# Altium project ELOAD.PrjPcb (part 1 of 2)
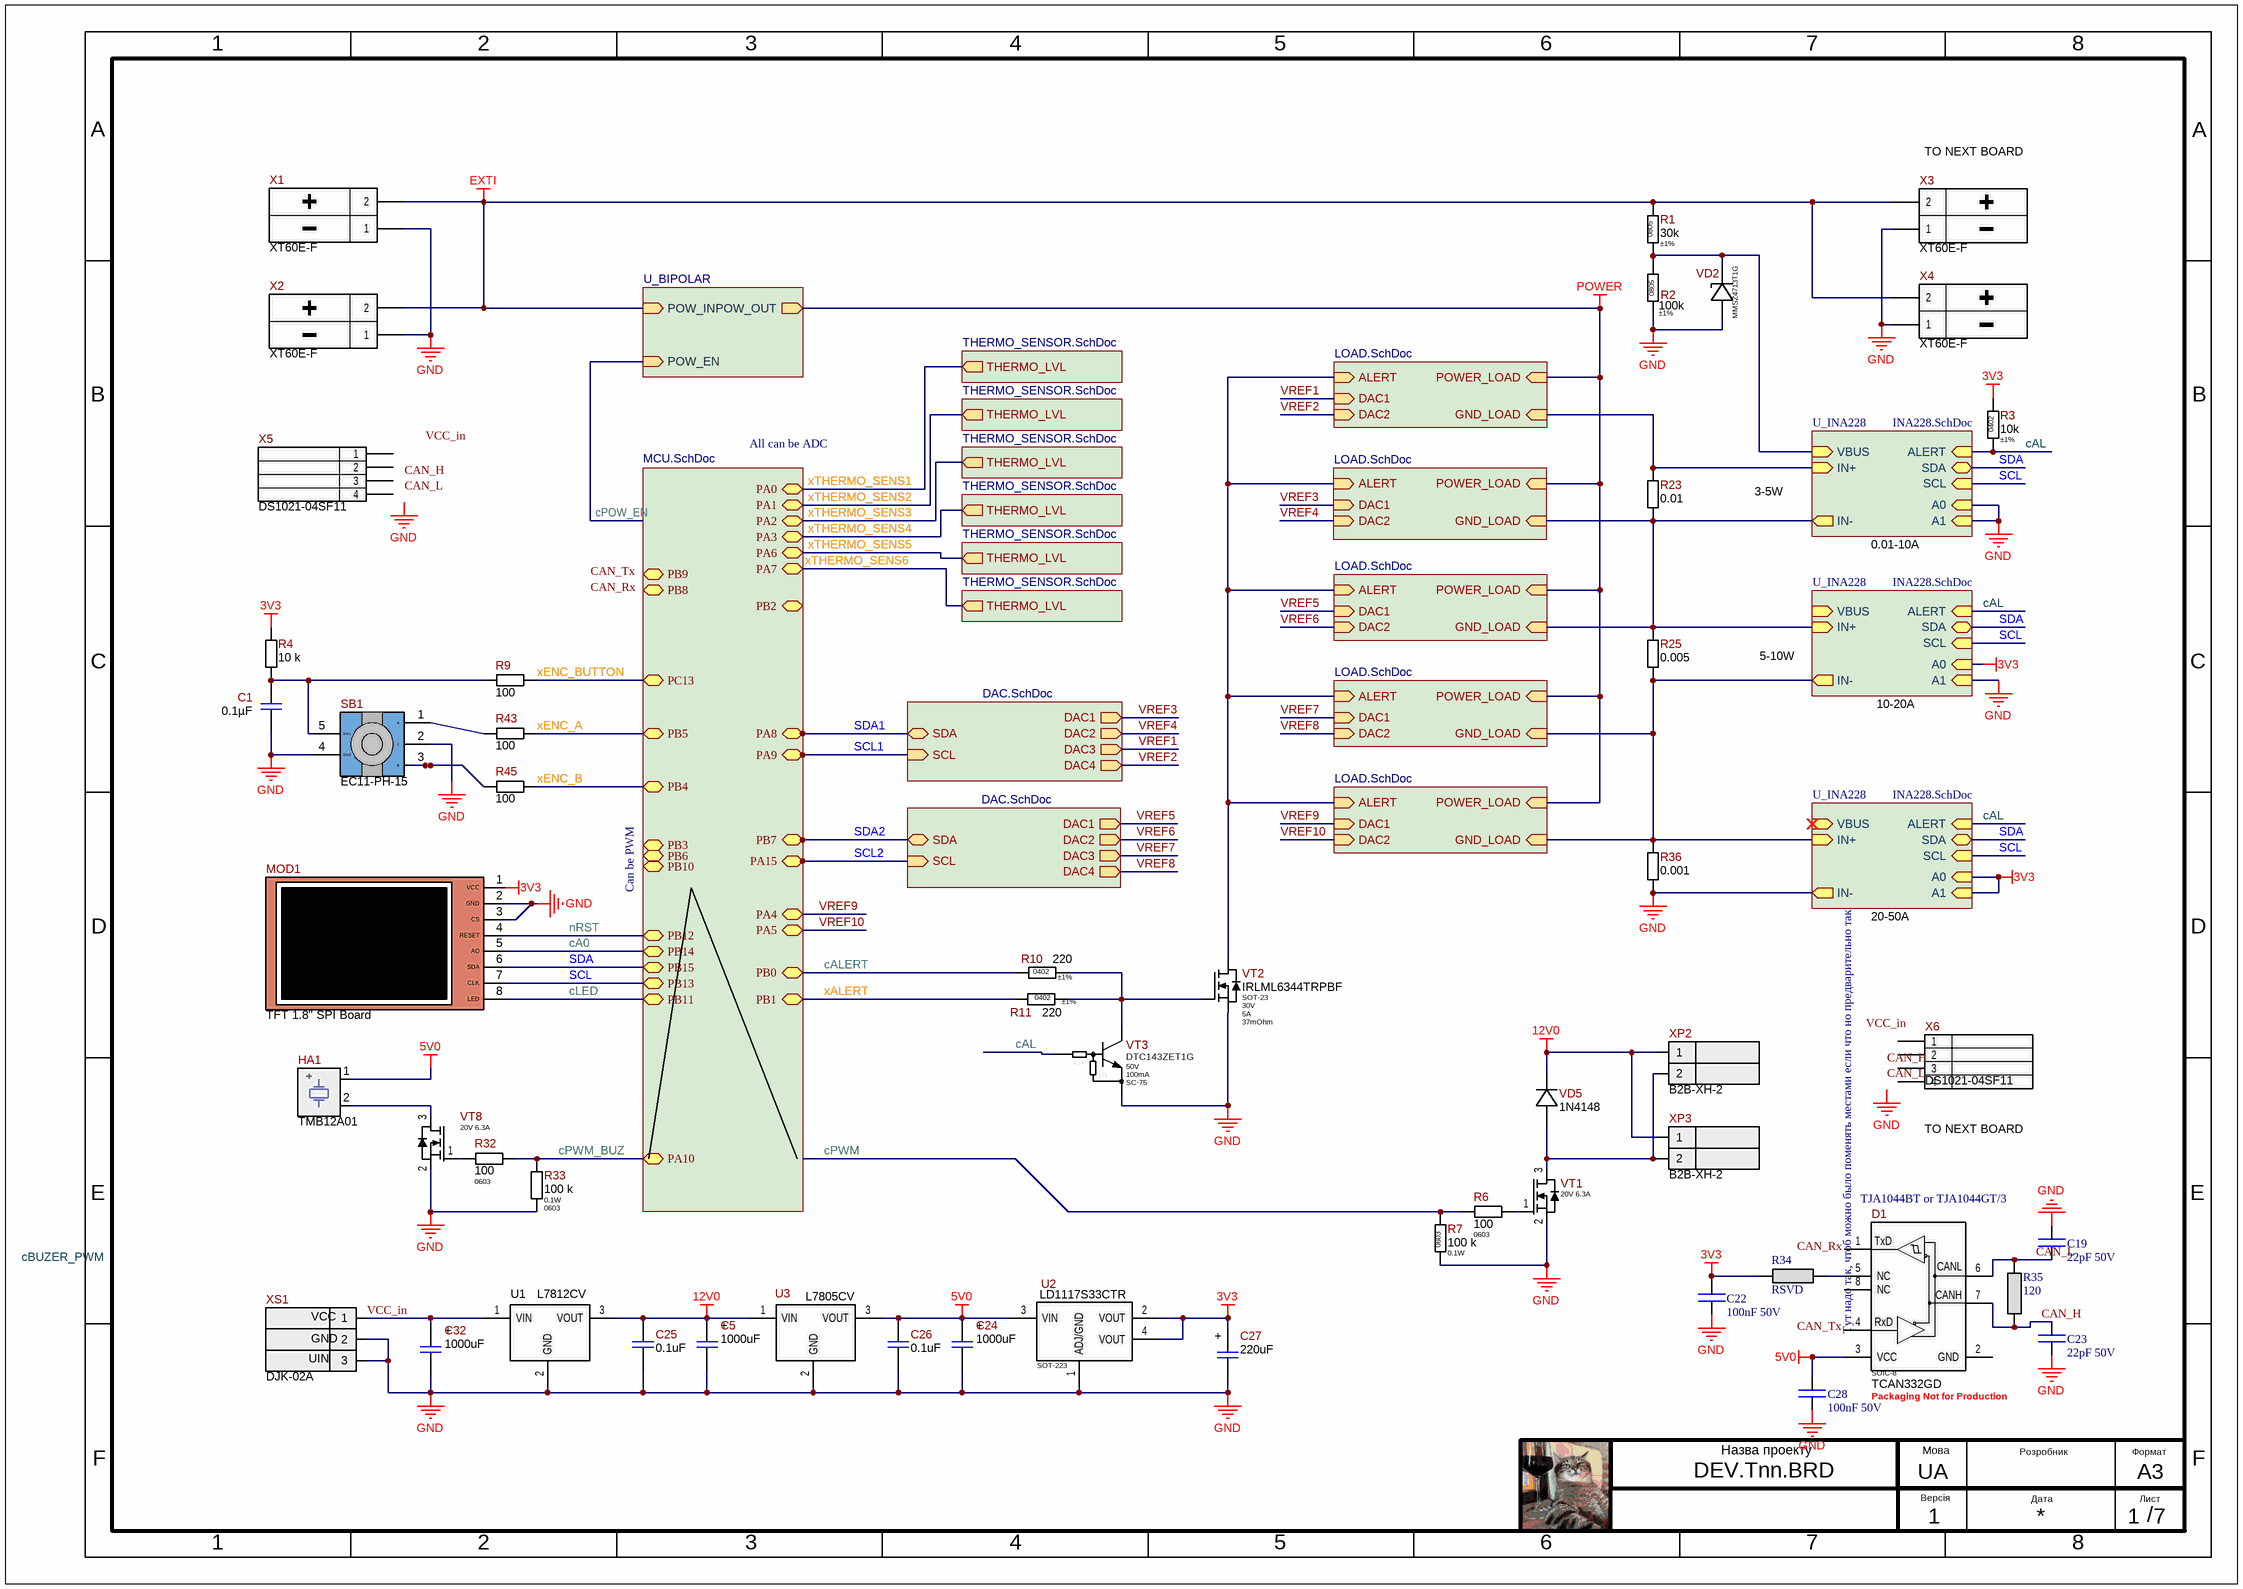
[diagram p0: ELOAD.SchDoc]
__Project_Template_Version: 1.0.3; _PCB_Order_Thickness: 1.6 mm; _PCB_Order_Size: 0 x 0 mm; _PCB_Order_SilkColor: White; _PCB_Order_Silk: Yes; _PCB_Order_ProductionTime: 2 weeks; _PCB_Order_MinHole: 0.3 mm; _PCB_Order_Material: FR-4; _PCB_Order_MaskColor: Green / Yellow; _PCB_Order_Mask: on both sides; _PCB_Order_LayersCnt: 2; _PCB_Order_Finish: HASL; _PCB_Order_ElectricTest: Necessarily for 100% samples; _PCB_Order_Cooper: 1oz / 35um; _PCB_Order_CastellatedHolesEdges: No; _PCB_Order_BoardOutlineLayer: Mechanical1 (GM1); _PCB_Order_Accuracy: 0.2mm / 8mil; _Amount_Boards_Per_Stand: 1; Project_Version: 1; Project_ID: 621; Product_Name: DEV.Tnn.BRD
7 sheets, 303 parts. Net scope: hierarchical (ports join the sheet entries above them; power ports are global).
Board file: MTB.TEMPLATE.PcbDoc
Sheets:
  ELOAD.SchDoc
    THERMO_SENSOR = THERMO_SENSOR.SchDoc
    U_MTB.ESP32-S3 = MCU.SchDoc
    U_DAC = DAC.SchDoc
    U_INA228 = INA228.SchDoc
    U_INA228 = INA228.SchDoc
    U_INA228 = INA228.SchDoc
    U_BIPOLAR = INKEY.SchDoc
    U_DAC = DAC.SchDoc
    LOAD = LOAD.SchDoc
    LOAD = LOAD.SchDoc
    LOAD = LOAD.SchDoc
    LOAD = LOAD.SchDoc
    LOAD = LOAD.SchDoc
    THERMO_SENSOR = THERMO_SENSOR.SchDoc
    THERMO_SENSOR = THERMO_SENSOR.SchDoc
    THERMO_SENSOR = THERMO_SENSOR.SchDoc
    THERMO_SENSOR = THERMO_SENSOR.SchDoc
    THERMO_SENSOR = THERMO_SENSOR.SchDoc

## Sheet ELOAD.SchDoc: =DocumentName
size 420 x 297 mm; CompanyName: "AS Manufacturing" LLC; Organization: "AS Manufacturing" LLC; Address1: 5 Sklyarenka St.; Address2: Kyiv 04073; Address3: Ukraine; Address4: https://ajax.systems/en/; DocumentNumber: 1; Revision: v1; SheetNumber: 1; SheetTotal: 7; Product name: DEV.Tnn.BRD; Internal reference: 621; Head: DEV.Tnn.BRD.621.v1; PCB_Designator: DEV.Tnn.BRD.621.v1; Template_version: 1.0.1

### Parts
C1  0.1µF  [C0603(1608)]
C5  1000uF  [CAP 10x16]
C19  22pF 50V  [0805CAP]
C22  100nF 50V  [0805CAP]
C23  22pF 50V  [0805CAP]
C24  1000uF  [CAP 10x16]
C25  0.1uF  [C0603(1608)]
C26  0.1uF  [C0603(1608)]
C27  220uF  [CASE_D(7343)]
C28  100nF 50V  [0805CAP]
C32  1000uF  [CAP 10x16]
D1  Package: SOIC-8  Lifecycle: Packaging Not for Production  [SOIC-8_W3.9MM]  (hidden comment: TCAN332GD)
HA1  TMB12A01  [KPX-1205A]
MOD1  TFT 1.8" SPI Board  [1.8_TFT_BOARD]
R1  Tolerance: ±1%  Package: 0805  [R_ANY_CHIP_0805_MED]  (hidden comment: 30k)
R2  Tolerance: ±1%  Package: 0805  [R_ANY_CHIP_0805_MED]  (hidden comment: 100k)
R3  Tolerance: ±1%  Package: 0402  [R_ANY_CHIP_0402_MED]  (hidden comment: 10k)
R4  10 k  [R0603]
R6  100  Package/Case: 0603  [R0603]
R7  100 k  Power Rating: 0.1W  Package/Case: 0603  [R0603]
R9  100  [R0603]
R10  Tolerance: ±1%  Package: 0402  [R_ANY_CHIP_0402_MED]  (hidden comment: 220)
R11  Tolerance: ±1%  Package: 0402  [R_ANY_CHIP_0402_MED]  (hidden comment: 220)
R23  0.01  [SHUNT10]
R25  0.005  [SHUNT10]
R32  100  Package/Case: 0603  [R0603]
R33  100 k  Power Rating: 0.1W  Package/Case: 0603  [R0603]
R34  RSVD  [RES0402]
R35  120  [Res0805]
R36  0.001  [SHUNT10]
R43  100  [R0603]
R45  100  [R0603]
SB1  EC11-PH-15  [EC11-PH-15]
U1  L7812CV  [TO220-AB-H]
U2  Package: SOT-223  Part Number: LD1117S33CTR  [SOT223]  (hidden comment: LD1117STR)
U3  L7805CV  [DPAK]
VD2  MMSZ4713T1G  [SOD-123_MED]
VD5  1N4148  [D0805]
VT1  Power Rating: 20V 6.3A  [SOT-23]  (hidden comment: IRLML6244)
VT2  Part Number: IRLML6344TRPBF  Package: SOT-23  Vds: 30V  Id: 5A  Rds: 37mOhm  [SOT-23_MED]  (hidden comment: IRLML6344)
VT3  Vce: 50V  Ic: 100mA  Package: SC-75  [SOT-416]  (hidden comment: DTC143ZET1G)
VT8  Power Rating: 20V 6.3A  [SOT-23]  (hidden comment: IRLML6244)
X1  XT60E-F  [XT60E-F]
X2  XT60E-F  [XT60E-F]
X3  XT60E-F  [XT60E-F]
X4  XT60E-F  [XT60E-F]
X5  Part Number: DS1021-04SF11  [DS1021-04S]  (hidden comment: PLS-4 (Part of PLS-40))
X6  Part Number: DS1021-04SF11  [DS1021-04S]  (hidden comment: PLS-4 (Part of PLS-40))
XP2  B2B-XH-2  [B2B-XH-2]
XP3  B2B-XH-2  [B2B-XH-2]
XS1  DJK-02A  [DC-140-003]

### Sub-sheets
LOAD = LOAD.SchDoc: DAC1 (in), ALERT (in), POWER_LOAD (in), DAC2 (in), GND_LOAD (in)
LOAD = LOAD.SchDoc: DAC1 (in), ALERT (in), POWER_LOAD (in), DAC2 (in), GND_LOAD (in)
LOAD = LOAD.SchDoc: DAC1 (in), ALERT (in), POWER_LOAD (in), DAC2 (in), GND_LOAD (in)
LOAD = LOAD.SchDoc: DAC1 (in), ALERT (in), POWER_LOAD (in), DAC2 (in), GND_LOAD (in)
LOAD = LOAD.SchDoc: DAC1 (in), ALERT (in), POWER_LOAD (in), DAC2 (in), GND_LOAD (in)
THERMO_SENSOR = THERMO_SENSOR.SchDoc: THERMO_LVL (out)
THERMO_SENSOR = THERMO_SENSOR.SchDoc: THERMO_LVL (out)
THERMO_SENSOR = THERMO_SENSOR.SchDoc: THERMO_LVL (out)
THERMO_SENSOR = THERMO_SENSOR.SchDoc: THERMO_LVL (out)
THERMO_SENSOR = THERMO_SENSOR.SchDoc: THERMO_LVL (out)
THERMO_SENSOR = THERMO_SENSOR.SchDoc: THERMO_LVL (out)
U_BIPOLAR = INKEY.SchDoc: POW_EN (in), POW_IN (in), POW_OUT (out)
U_DAC = DAC.SchDoc: SCL (in), SDA (bidir), DAC1 (out), DAC2 (out), DAC3 (out), DAC4 (out)
U_DAC = DAC.SchDoc: SCL (in), SDA (bidir), DAC1 (out), DAC2 (out), DAC3 (out), DAC4 (out)
U_INA228 = INA228.SchDoc: IN+ (in), IN- (out), A0 (in), ALERT (in), VBUS (in), A1 (in), SCL (in), SDA (bidir)
U_INA228 = INA228.SchDoc: IN+ (in), IN- (out), A0 (in), ALERT (in), VBUS (in), A1 (in), SCL (in), SDA (bidir)
U_INA228 = INA228.SchDoc: IN+ (in), IN- (out), A0 (in), ALERT (in), VBUS (in), A1 (in), SCL (in), SDA (bidir)
U_MTB.ESP32-S3 = MCU.SchDoc: PA0 (bidir), PA1 (bidir), PA2 (bidir), PA3 (bidir), PA4 (bidir), PA5 (bidir), PA6 (bidir), PA7 (bidir), PA8 (bidir), PA9 (bidir), PA10 (bidir), PA15 (bidir), PB0 (bidir), PB1 (bidir), PB2 (bidir), PB3 (bidir), PB4 (bidir), PB5 (bidir), PB6 (bidir), PB7 (bidir), PB8 (bidir), PB9 (bidir), PB10 (bidir), PB11 (bidir), PB12 (bidir), PB13 (bidir), PB14 (bidir), PB15 (bidir), PC13 (bidir)

### Nets
3V3: C22.2 C27.1 MOD1.1(VCC) R3.1 R4.2 R34.1 U2.2(VOUT) U2.4(VOUT) ; sheet U_INA228/A0, sheet U_INA228/A0, sheet U_INA228/A1
5V0: C24.1 C26.1 C28.2 D1.3(VCC) HA1.1(Vcc) U2.3(VIN) U3.3(VOUT)
12V0: C5.1 C25.1 U1.3(VOUT) U3.1(VIN) VD5.1(K) XP2.1 XP3.1
EXTI: R1.1 X1.2 X2.2 X3.2 X4.2 ; sheet U_BIPOLAR/POW_IN
GND: C1.2 C5.2 C19.2 C22.1 C23.1 C24.2 C25.2 C26.2 C27.2 C28.1 C32.2 MOD1.2(GND) MOD1.3(CS) R2.2 R7.1 R33.1 R36.1 SB1.2(C) SB1.4(SW2) U1.2(GND) U2.1(ADJ/GND) U3.2(GND) VD2.AN VT1.2(S) VT2.2(S) VT3.2(E) VT8.2(S) X1.1 X2.1 X3.1 X4.1 XS1.2 XS1.3 ; sheet U_INA228/A0, sheet U_INA228/A1, sheet U_INA228/A1, sheet U_INA228/IN-
POWER: sheet U_BIPOLAR/POW_OUT, sheet LOAD/POWER_LOAD, sheet LOAD/POWER_LOAD, sheet LOAD/POWER_LOAD, sheet LOAD/POWER_LOAD, sheet LOAD/POWER_LOAD
cA0: MOD1.5(AO) ; sheet U_MTB.ESP32-S3/PB14
cAL: R3.2 VT3.1(B) ; sheet U_INA228/ALERT, sheet U_INA228/ALERT, sheet U_INA228/ALERT
cALERT: R10.1 ; sheet U_MTB.ESP32-S3/PB0
CAN_H: C23.2 D1.7(CANH) R35.1
CAN_L: C19.1 D1.6(CANL) R35.2
cLED: MOD1.8(LED) ; sheet U_MTB.ESP32-S3/PB11
cPWM: R6.1 R7.2
cPWM_BUZ: R32.1 R33.2 ; sheet U_MTB.ESP32-S3/PA10
nRST: MOD1.4(RESET) ; sheet U_MTB.ESP32-S3/PB12
SCL: MOD1.7(CLK) ; sheet U_MTB.ESP32-S3/PB13, sheet U_INA228/SCL, sheet U_INA228/SCL, sheet U_INA228/SCL
SCL1: sheet U_MTB.ESP32-S3/PA9, sheet U_DAC/SCL
SCL2: sheet U_MTB.ESP32-S3/PA15, sheet U_DAC/SCL
SDA: MOD1.6(SDA) ; sheet U_MTB.ESP32-S3/PB15, sheet U_INA228/SDA, sheet U_INA228/SDA, sheet U_INA228/SDA
SDA1: sheet U_MTB.ESP32-S3/PA8, sheet U_DAC/SDA
SDA2: sheet U_MTB.ESP32-S3/PB7, sheet U_DAC/SDA
VCC_in: C32.1 U1.1(VIN) XS1.1
VREF1: sheet U_DAC/DAC3, sheet LOAD/DAC1
VREF2: sheet U_DAC/DAC4, sheet LOAD/DAC2
VREF3: sheet U_DAC/DAC1, sheet LOAD/DAC1
VREF4: sheet U_DAC/DAC2, sheet LOAD/DAC2
VREF5: sheet U_DAC/DAC1, sheet LOAD/DAC1
VREF6: sheet U_DAC/DAC2, sheet LOAD/DAC2
VREF7: sheet U_DAC/DAC3, sheet LOAD/DAC1
VREF8: sheet U_DAC/DAC4, sheet LOAD/DAC2
VREF9: sheet U_MTB.ESP32-S3/PA4, sheet LOAD/DAC1
VREF10: sheet U_MTB.ESP32-S3/PA5, sheet LOAD/DAC2
xALERT: R11.1 ; sheet U_MTB.ESP32-S3/PB1
xENC_A: R43.2 ; sheet U_MTB.ESP32-S3/PB5
xENC_B: R45.2 ; sheet U_MTB.ESP32-S3/PB4
xENC_BUTTON: R9.2 ; sheet U_MTB.ESP32-S3/PC13
xTHERMO_SENS1: sheet THERMO_SENSOR/THERMO_LVL, sheet U_MTB.ESP32-S3/PA0
xTHERMO_SENS2: sheet U_MTB.ESP32-S3/PA1, sheet THERMO_SENSOR/THERMO_LVL
xTHERMO_SENS3: sheet U_MTB.ESP32-S3/PA2, sheet THERMO_SENSOR/THERMO_LVL
xTHERMO_SENS4: sheet U_MTB.ESP32-S3/PA3, sheet THERMO_SENSOR/THERMO_LVL
xTHERMO_SENS5: sheet U_MTB.ESP32-S3/PA6, sheet THERMO_SENSOR/THERMO_LVL
xTHERMO_SENS6: sheet U_MTB.ESP32-S3/PA7, sheet THERMO_SENSOR/THERMO_LVL
NetC1_1: C1.1 R4.1 R9.1 SB1.5(SW1)
NetD1_5: D1.5(NC) R34.2
NetD2C_8: R1.2 R2.1 VD2.CA ; sheet U_INA228/VBUS
NetHA1_2: HA1.2(GND) VT8.3(D)
NetR6_2: R6.2 VT1.1(G)
NetR10_2: R10.2 R11.2 VT2.1(G) VT3.3(C)
NetR17A_1: R23.2 ; sheet U_INA228/IN+, sheet LOAD/GND_LOAD
NetR17B_1: R23.1 R25.2 ; sheet U_INA228/IN-, sheet U_INA228/IN+, sheet LOAD/GND_LOAD, sheet LOAD/GND_LOAD
NetR17C_1: R25.1 R36.2 ; sheet U_INA228/IN-, sheet U_INA228/IN+, sheet LOAD/GND_LOAD, sheet LOAD/GND_LOAD
NetR32_2: R32.2 VT8.1(G)
NetR43_1: R43.1 SB1.1(A)
NetR45_1: R45.1 SB1.3(B)
NetVD3A_CA: VT2.3(D) ; sheet LOAD/ALERT, sheet LOAD/ALERT, sheet LOAD/ALERT, sheet LOAD/ALERT, sheet LOAD/ALERT
NetVD5_2: VD5.2(A) VT1.3(D) XP2.2 XP3.2

Not connected (* = marked no-connect by the designer): D1 1(TxD) 2(GND) 4(RxD) 8(NC); X5 1 2 3 4; X6 1 2 3 4

### Notes on the sheet
- (near X3) TO NEXT BOARD
- All can be ADC
- 3-5W
- 0.01-10A
- 5-10W
- 10-20A
- Can be PWM
- 20-50A
- (near X6) TO NEXT BOARD
- TJA1044BT or TJA1044GT/3
- Тут надо так, чтоб можно было поменять местами если что но предварительно так
- Labels drawn without touching a wire or pin: CAN_H, CAN_L, CAN_Rx, CAN_Tx, cBUZER_PWM, GND, VCC_in
- 1
- 2
- 3
- 4
- 5
- 6
- 7
- 8
- A
- B
- C
- D
- E
- F
- Назва проекту
- Мова
- UA
- Розробник
- Формат
- A3
- Версія
- Дата
- Лист
- /
- (in symbol 220uF  10V CASE-D) +
- (in symbol 1000uF  16V 10x16(EHR)) +
- (in symbol DJK-02A) VCC; GND; UIN
- (in symbol DTC143ZET1G) 4.7k; 47k

### Library data of the parts
C1 = 0.1µF  50V C0603: CAP CER 0.1UF 50V X7R 0603; Manufacturer: Samsung Electro-Mechanics; Manufacturer P/N: CL10B104KB8WPNC; Name Component: Capacitor Ceramic; Tolerance: ±10%; Operation Temperature: -55°C ~ 125°C; Notes: 06035C104K4T4A, 06035C104K4T2A; Library Path 1: Capacitors.SchLib; Part Number: 0.1µF  50V C0603; Value: 0.1µF; Temperature Coefficient: X7R; Power (V/A): 50V; Package/Case: C0603; Supplier 1: Digi-key; Supplier Part Number 1: 1276-6854-2-ND; ComponentLink1Description: Datasheet; ComponentLink1URL: https://www.samsungsem.com/resources/file/global/support/product_catalog/MLCC.pdf
C5 C24 C32 = 1000uF  16V 10x16(EHR): 1000uF 20% 16V EHR 10x16mm; Manufacturer: Hitano; Manufacturer P/N: EHR102M16BA; Name Component: Electrolytic capacitor; Operation Temperature: −40°C to +105°C; Library Path 1: Capacitors.SchLib; Part Number: 1000uF  16V 10x16(EHR); Value: 1000uF; Tolerance: ±20%; Power (V/A): 16V; Package/Case: 10x16(EHR); Supplier 1: RCS; ComponentLink1Description: Datasheet; ComponentLink1URL: https://www.rcscomponents.kiev.ua/datasheets/EHR_081225.pdf
C19 C22 C23 C28 = CAP0805: 0805 CAP 100nF 50V
C25 C26 = 0.1uF  50V C0603: CAP CER 0.1UF 50V X7R 0603; Manufacturer: Samsung Electro-Mechanics; Manufacturer P/N: CL10B104KB8WPNC; Name Component: Capacitor Ceramic; Tolerance: ±10%; Operation Temperature: -55°C ~ 125°C; Library Path 1: Capacitors.SchLib; Notes: 06035C104K4T4A, 06035C104K4T2A; Part Number: 0.1uF  50V C0603; Value: 0.1uF; Temperature Coefficient: X7R; Power (V/A): 50V; Package/Case: C0603; Supplier Part Number 1: 1276-6854-2-ND; ComponentLink1Description: Datasheet; Supplier 1: Digi-key; ComponentLink1URL: https://www.samsungsem.com/resources/file/global/support/product_catalog/MLCC.pdf
C27 = 220uF  10V CASE-D: CAP TANT 220UF 20% 10V 2917; Manufacturer: KEMET; Manufacturer P/N: T491D227M010AT; Name Component: CapacitorTantalum; Operation Temperature: -55°C ~ 125°C; Library Path 1: Capacitors.SchLib; Part Number: 220uF  10V CASE-D; Value: 220uF; Tolerance: ±20%; Temperature Coefficient: -; Power (V/A): 10V; Package/Case: CASE-D; Supplier 1: Digi-key; Supplier Part Number 1: 399-9744-2-ND; ComponentLink1Description: Datasheet; ComponentLink1URL: https://content.kemet.com/datasheets/KEM_T2005_T491.pdf
D1 = TCAN332GD: 3.3V Half Duplex CAN Transceivers with CAN FD, 5 Mbps, SOIC-8; Manufacturer: Texas Instruments; Ajax_1C_PN: NONE; Ajax_1С_Status: RND Only; Component Status: Released; Standard Lead Time: 56 Weeks; Part Number: TCAN332GD; Part Type: Transceivers / CAN; Component Type: SMD; Temperature Range: -40°C ~ 125°C; ComponentLink1URL: https://www.ti.com/lit/ds/symlink/tcan334g.pdf; Supplier 1: Mouser; Supplier Part Number 1: 595-TCAN332GD; Replacement: NONE; Price: NONE; ComponentLink1Description: Datasheet
HA1 = TMB12A01: AUDIO MAGNETIC 1.2-2.5 V; Name Component: Buzzer; Operation Temperature: -20 °C to +70 °C; Power (V/A): 1,2...2,5 V; Library Path 1: Others.SchLib; ComponentDescription: Buzzer  TMB12A01  (12x9.5); Part Number: TMB12A01; Value: TMB12A01; Supplier 1: Kosmodrom; Supplier Part Number 1: TMB12A01; ComponentLink1Description: Datasheet; ComponentLink1URL: http://www.kosmodrom.com.ua/el.php?name=TMB12A01; AbridgedComponentDescription: TMB12A01; Package/Case: 12x9.5
MOD1 = TFT 1.8" SPI Board: Display Board TFT 1.8" SPI Driver ST7735S with SD; Operation Temperature: -40°C ~ 85°C; Power (V/A): 3.3 V; Library Path 1: Module.SchLib; Part Number: TFT 1.8" SPI Board; Name Component: Display; Value: TFT 1.8" SPI Board; Package/Case: 56x35mm; ComponentLink1Description: Datasheet
R1 = RC0805FR-0730KL: 30 kOhms ±1%, 1/8W 0805 Thick Film Resistor; Manufacturer: Yageo; Ajax_1C_ID: 9642; Ajax_1C_PN: 30k 1% 0805 Resistors SMD RoHS; Ajax_1С_Status: Mass Production; Power Rating: 0.125W; Voltage: 150V; Component Status: Released; Temperature Stability: ±100ppm/°C; Replacement: NONE; GUID_1C: 71e2aa09-07e0-11e7-82d0-d8cb8a9acc66; Value: 30k; Part Number: RC0805FR-0730KL; Component Type: SMD; Part Type: Thick Film; Temperature Range: -55°C ~ 155°C; ComponentLink1URL: https://eu.mouser.com/datasheet/2/447/PYu_RC_Group_51_RoHS_L_10-1664068.pdf; Supplier 1: Digi-Key; Supplier Part Number 1: 311-30.0KCRTR-ND; Price: 0.0014; ComponentLink1Description: Datasheet
R2 = RC0805FR-07100KL: 100 kOhms ±1%, 1/8W 0805 Thick Film Resistor; Manufacturer: Yageo; Ajax_1C_ID: 7487; Ajax_1C_PN: 100k 1% 0805 Resistors SMD RoHS; Ajax_1С_Status: Mass Production; Power Rating: 0.125W; Voltage: 150V; Component Status: Released; Temperature Stability: ±100ppm/°C; Replacement: NONE; GUID_1C: 0fb4516d-b2dc-11e5-8119-d8cb8a9acc66; Value: 100k; Part Number: RC0805FR-07100KL; Component Type: SMD; Part Type: Thick Film; Temperature Range: -55°C ~ 155°C; ComponentLink1URL: https://eu.mouser.com/datasheet/2/447/PYu_RC_Group_51_RoHS_L_10-1664068.pdf; Supplier 1: Digi-Key; Supplier Part Number 1: 311-100KCRTR-ND; Price: 0.0014; ComponentLink1Description: Datasheet
R3 R10 R11 = RC0402FR-07220RL: 220 Ohms ±1% 1/16W 0402 Thick Film Resistor; Manufacturer: Yageo; Ajax_1C_ID: 6466; Ajax_1C_PN: 220R 1% 0402 Resistors SMD RoHS; Power Rating: 0.062W; Voltage: 50V; Temperature Stability: ±100ppm/°C; Replacement: NONE; Ajax_1С_Status: Mass Production; Component Status: Released; GUID_1C: c8eea36b-fd66-11e4-ad28-a45d36c4a9e5; Part Number: RC0402FR-07220RL; Component Type: SMD; Temperature Range: -55°C ~ 155°C; ComponentLink1URL: https://eu.mouser.com/datasheet/2/447/PYu_RC_Group_51_RoHS_L_10-1664068.pdf; ComponentLink1Description: Datasheet; Part Type: Thick Film; Price: 0.00065
  R3: Value: 10k
  R10 R11: Value: 220
R4 = 10 k  R0603: RES SMD 10 k OHM  ±1% 1/10W 0603; Power Rating: 0.1W; Name Component: Resistror; Operation Temperature: -55℃ to 155℃; Temperature Coefficient: ±100 ppm/°C; Library Path 1: Resistor.SchLib; Value: 10 k; Part Number: 10 k  R0603
R6 R32 = 100  R0603: RES SMD 100 OHM  ±1% 1/10W 0603; Power Rating: 0.1W; Name Component: Resistror; Operation Temperature: -55℃ to 155℃; Temperature Coefficient: ±100 ppm/°C; Library Path 1: Resistor.SchLib; Part Number: 100  R0603; Value: 100; Tolerance: ±1%
R7 R33 = 100 k  R0603: RES SMD 100 k OHM  ±1% 1/10W 0603; Name Component: Resistror; Operation Temperature: -55℃ to 155℃; Temperature Coefficient: ±100 ppm/°C; Library Path 1: Resistor.SchLib; Part Number: 100 k  R0603; Value: 100 k; Tolerance: ±1%
R9 R43 R45 = 100  R0603: RES SMD 100 OHM  ±1% 1/10W 0603; Name Component: Resistror; Operation Temperature: -55℃ to 155℃; Temperature Coefficient: ±100 ppm/°C; Library Path 1: Resistor.SchLib; Part Number: 100  R0603; Value: 100; Tolerance: ±1%
R23 R25 R36 = 0.001  Resistor: SHUNT; Name Component: Resistror; Tolerance: ±5%; Operation Temperature: -55℃ to 155℃; Temperature Coefficient: ±200 ppm/°C; Library Path 1: Resistor.SchLib; Part Number: 0.001  Resistor
  R23: Value: 0.01
  R25: Value: 0.005
  R36: Value: 0.001
R34 = RES0402: 0402 RES 10k
R35 = RES0805: 0805 RES 120
SB1 = EC11-PH-15: Alps Alpine; Manufacturer P/N: EC11E15244B2; Operation Temperature: -20°C ~ 70°C; Power (V/A): 5V 10mA; Library Path 1: Switches.SchLib; Part Number: EC11-PH-15; Name Component: Encoder; Value: EC11-PH-15; Supplier 1: Digi-key; ComponentLink1Description: Datasheet; ComponentLink1URL: https://tech.alpsalpine.com/e/products/detail/EC11E15244B2/; AbridgedComponentDescription: EC11-PH-15
U1 = L7812CV: IC REG LINEAR 12V 500MA DPAK; Manufacturer: STMicroelectronics; Name Component: Linear Voltage Regulator; Operation Temperature: 0°C ~ 150°C; Power (V/A): 14 ... 35V; Library Path 1: Power converters.SchLib; ComponentDescription: Linear Voltage Regulator L7812CV   (D-PAK); Part Number: L7812CV; Value: L7812CV; Package/Case: D-PAK; Supplier 1: Digi-key; ComponentLink1Description: Datasheet; ComponentLink1URL: https://mm.digikey.com/Volume0/opasdata/d220001/medias/docus/2578/L78MxxAB%2CAC%20.pdf
U2 = LD1117S33CTR: IC REG LINEAR 3.3V 800MA SOT223; Manufacturer: STMicroelectronics; Name Component: Linear Regulators; Operation Temperature: -40°C ~ 125°C; Power (V/A): 0.8 A 3.3 В; Library Path 1: Power converters.SchLib; ComponentDescription: Linear Regulators  LD1117S33CTR  (SOT-223); Part Type: Power / Linear Regulator; Component Type: SMD; Temperature Range: 0°C ~ 125°C; ComponentLink1URL: https://www.st.com/content/ccc/resource/technical/document/datasheet/99/3b/7d/91/91/51/4b/be/CD00000544.pdf/files/CD00000544.pdf/jcr:content/translations/en.CD00000544.pdf; Supplier 1: Digi-key; Supplier Part Number 1: 497-1241-2-ND; Price: 0,11994941; ComponentLink1Description: Datasheet; Value: LD1117S33CTR; Package/Case: SOT-223; Manufacturer P/N: LD1117S33CTR
U3 = L7805CV: IC REG LINEAR 5V 1.5A DPAK; Manufacturer: STMicroelectronics; Manufacturer P/N: L7805CDT-TR; Name Component: Linear Voltage Regulator; Operation Temperature: 0°C ~ 150°C; Power (V/A): 5V 1.5A; Library Path 1: Power converters.SchLib; ComponentDescription: Linear Voltage Regulator L7805CV   (TO-220); Part Number: L7805CV; Value: L7805CV; Package/Case: TO-220; Supplier 1: Digi-key; Supplier Part Number 1: 497-7255-2-ND; ComponentLink1Description: Datasheet
VD2 = MMSZ4713T1G: Zener Diode 30V, 500mW, ±5%, SOD-123; Manufacturer: Onsemi; Ajax_1C_ID: 49763; Ajax_1C_PN: MMSZ4713T1G SOD123 30V Zener Diode OnSemi; Ajax_1С_Status: RND Only; Component Status: Released; Marking: ED; Standard Lead Time: 52 Weeks; Replacement: NONE; GUID_1C: 9c895df6-3100-11ed-a363-005056994834; Part Number: MMSZ4713T1G; Package: SOD-123; Voltage: 30V; Part Type: Zener; Component Type: SMD; Temperature Range: -55°C ~ 150°C; ComponentLink1URL: https://eu.mouser.com/datasheet/2/308/MMSZ4678T1_D-1389385.pdf; Supplier 1: Mouser; Supplier Part Number 1: 863-MMSZ4713T1G; Price: 0.031; ComponentLink1Description: Datasheet
VD5 = 1N4148: DIODE GEN PURP 75V 250MA SOD323; Manufacturer: Diodes Incorporated; Operation Temperature: -55°C ~ 150°C; Library Path 1: Diodes.SchLib; Power Rating: 75V 250mA; Part Number: 1N4148; Name Component: Diode; Value: 1N4148; Package/Case: SOD-80; Manufacturer P/N: 1N4148; Supplier 1: Digi-key; Supplier Part Number 1: 1N4148; ComponentLink1Description: Datasheet
VT1 VT8 = IRLML6244: MOSFET N-CH 20V 6.3A SOT-23; Manufacturer: InfineonTechnologies; Manufacturer P/N: IRLML6244TRPBF; Name Component: Transistor; Operation Temperature: -55°C ~ 150°C (TJ); Library Path 1: Transistors.SchLib; ComponentLink1URL: https://www.infineon.com/dgdl/irlml6244pbf.pdf?fileId=5546d462533600a4015356686fed261f; ComponentLink1Description: Datasheet; Part Number: IRLML6244; Value: IRLML6244; Package/Case: SOT-23; Supplier 1: Digi-key; Supplier Part Number 1: IRLML6244TRPBFTR-ND
VT2 = IRLML6344TRPBF: 30V, 5A max N-Channel HEXFET MOSFET, 29mOhm @ Vgs = 4.5V; Manufacturer: Infineon Technologies; Ajax_1C_ID: 9416; Ajax_1C_PN: IRLML6344TRPBF  SOT23. полевой транзистор; Ajax_1С_Status: Mass Production; Component Status: Released; Standard Lead Time: 16 Weeks; Replacement: NONE; GUID_1C: 8299d48f-df0c-11e6-829c-d8cb8a9acc66; Part Type: N-Channel; Component Type: SMD; Temperature Range: -55°C ~ 150°C; ComponentLink1URL: https://www.infineon.com/dgdl/irlml6344pbf.pdf?fileId=5546d462533600a4015356689c44262c; Supplier 1: Digi-Key; Supplier Part Number 1: IRLML6344TRPBFTR-ND; Price: 0.175; ComponentLink1Description: Datasheet
VT3 = DTC143ZET1G: 50V, 100mA Low Vce(sat) NPN Digital Transistor, Pre-Biased 4.7k/47k (with built-in resistors); Manufacturer: Onsemi; Ajax_1C_ID: 9410; Ajax_1C_PN: DTC143ZET1G SC-75-3  биполярный NPN транзистор; Ajax_1С_Status: Mass Production; Component Status: Released; Standard Lead Time: 8 Weeks; Replacement: NONE; GUID_1C: d76ac5d5-de69-11e6-829b-d8cb8a9acc66; Part Number: DTC143ZET1G; Part Type: NPN; Component Type: SMD; Temperature Range: -55°C ~ 150 °C; ComponentLink1URL: http://www.onsemi.com/pub/Collateral/DTC143Z-D.PDF; Supplier 1: Digi-Key; Supplier Part Number 1: DTC143ZET1GOSTR-ND; Price: 0,0125; ComponentLink1Description: Datasheet
X1-X4 = XT60E-F: 2 Pin DC Power Socket, XT60, Female, Straight, Yellow, 30A, 500V, Gold Flash; Manufacturer: Amass; Ajax_1C_PN: NONE; Ajax_1С_Status: RND Only; Component Status: Review_1; Part Number: XT60E-F; Part Type: Power Socket; Component Type: PTH; Temperature Range: -20°C ~ 120°C; ComponentLink1URL: https://www.tme.eu/Document/172e3180ebad396a946f7e08df14c4b2/XT60E-F.pdf; Supplier 1: TME; Supplier Part Number 1: XT60E-F; Replacement: NONE; Price: NONE; ComponentLink1Description: Datasheet
X5 X6 = DS1021-04SF11: 4 Pin 2.54mm Male Header, Vertical, 3mm and 6.1mm, PLS-4; Manufacturer: Connfly; Ajax_1C_ID: 1215; Ajax_1C_PN: PLS40, планки зі штирьками; Ajax_1С_Status: Mass Production; Component Status: Released; Replacement: NONE; GUID_1C: 10be163c-dd40-11e0-af93-6c626deda1bb; Part Type: Header / Male Pin / Single Row; Component Type: PTH; Temperature Range: -40°C ~ 105°C; ComponentLink1URL: \\altiumdb.ajax.local\files\Datasheet\Connectors\DS1021.pdf; Price: 0.00351512; ComponentLink1Description: Datasheet
XP2 XP3 = B2B-XH-2: CONN HEADER VERT 2POS 2.5MM; Manufacturer: JSTSalesAmericaInc.; Manufacturer P/N: B2B-XH-2(LF)(SN); Name Component: PCB Connector; Operation Temperature: -25°C ~ 85°C; Power (V/A): 3A/250V; Library Path 1: Connectors.SchLib; Part Number: B2B-XH-2; Value: B2B-XH-2; Package/Case: 2.5mm; Supplier 1: Digi-key; ComponentLink1Description: Datasheet; ComponentLink1URL: http://www.jst-belgium.be/downloads/series/TSSC018.00(XH).pdf
XS1 = DJK-02A: DC POWER JACK CONNECTOR 6.3MM; Manufacturer: KLS; Name Component: Power socket; Operation Temperature: -25°C ~ 85°C; Power (V/A): 2A/250V; Library Path 1: Connectors.SchLib; Part Number: DJK-02A; Value: DJK-02A; Package/Case: DJK-02A; Manufacturer P/N: DJK-02A; Supplier 1: -; ComponentLink1Description: Datasheet; ComponentLink1URL: https://static.chipdip.ru/lib/078/DOC001078433.pdf; System: Connector

## Sheet THERMO_SENSOR.SchDoc: =DocumentName
size 297 x 209 mm; CompanyName: "AS Manufacturing" LLC; Organization: "AS Manufacturing" LLC; Address1: 5 Sklyarenka St.; Address2: Kyiv 04073; Address3: Ukraine; Address4: https://ajax.systems/en/; DocumentNumber: 3; Revision: v1; SheetNumber: 3; SheetTotal: 7; Product name: DEV.Tnn.BRD; Internal reference: 621; Head: DEV.Tnn.BRD.621.v1; PCB_Designator: DEV.Tnn.BRD.621.v1; Template_version: 1.0.1
Used 6 times, as channels THERMO_SENSOR, THERMO_SENSOR, THERMO_SENSOR, THERMO_SENSOR, THERMO_SENSOR, THERMO_SENSOR. Parts and nets are listed once, with the designators drawn on the sheet.
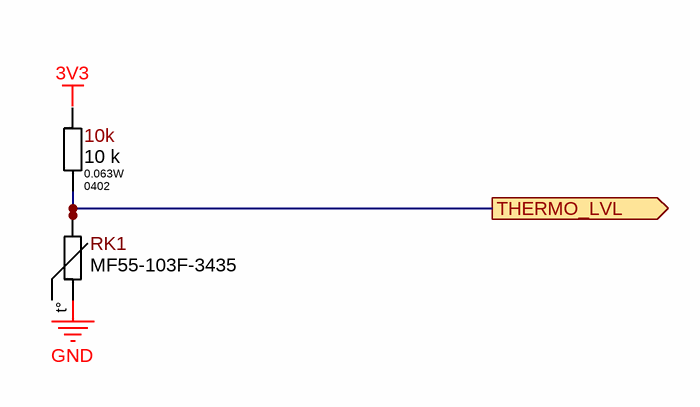
[diagram p1: THERMO_SENSOR.SchDoc]

### Parts
10k  10 k  Power Rating: 0.063W  Package/Case: 0402  [R0402]
RK1  MF55-103F-3435  [MF55-103F-3435]

### Ports
THERMO_LVL (out)

### Nets
GND: RK1.2
THERMO_LVL: 10k.1 RK1.1 ; port THERMO_LVL

Not connected (* = marked no-connect by the designer): 10k 2

### Channels
THERMO_SENSOR: designators end in D; ports THERMO_LVL=xTHERMO_SENS1
THERMO_SENSOR: designators end in C; ports THERMO_LVL=xTHERMO_SENS2
THERMO_SENSOR: designators end in B; ports THERMO_LVL=xTHERMO_SENS3
THERMO_SENSOR: designators 10k=10kE#1 RK1=RK1E; ports THERMO_LVL=xTHERMO_SENS4
THERMO_SENSOR: designators 10k=10kE#2 RK1=RK1A; ports THERMO_LVL=xTHERMO_SENS5
THERMO_SENSOR: designators end in F; ports THERMO_LVL=xTHERMO_SENS6

### Notes on the sheet
- Labels drawn without touching a wire or pin: 3V3
- 1
- 2
- 3
- 4
- 5
- 6
- C
- D
- E
- F
- Назва проекту
- Мова
- UA
- Розробник
- Формат
- A4
- Версія
- Дата
- Лист
- /
- (in symbol MF55-103F-3435) t°

### Library data of the parts
10k = 10 k  R0402: RES SMD 10 k OHM  ±1% 1/16W 0402; Name Component: Resistror; Operation Temperature: -55℃ to 155℃; Temperature Coefficient: ±100 ppm/°C; Library Path 1: Resistor.SchLib; Part Number: 10 k  R0402; Value: 10 k; Tolerance: ±1%
RK1 = MF55-103F-3435: 10 kOhm ±1% Thermistors, Radial Leaded, 3435 K B Parameter, 28.5x3.6mm, Max 0.6mm Thickness; Manufacturer: Dongguan Tianrui Electronics Co; Ajax_1C_ID: 44964; Ajax_1C_PN: MF55-103F-3435 thermistor probe 10k ±1% 3.6*28.5mm Tianrui; Ajax_1С_Status: Mass Production; Component Status: Released; Replacement: NONE; GUID_1C: bce193fe-f38d-11ec-a361-005056994834; Part Number: MF55-103F-3435; Part Type: Thermistor; Component Type: PTH; Temperature Range: -40°C ~ 105°C; ComponentLink1URL: \\altiumdb.ajax.local\files\Datasheet\Miscellaneous\MF55-103F-3435.pdf; Price: 0.13; ComponentLink1Description: Datasheet

## Sheet MCU.SchDoc: =DocumentName
size 297 x 209 mm; CompanyName: "AS Manufacturing" LLC; Organization: "AS Manufacturing" LLC; Address1: 5 Sklyarenka St.; Address2: Kyiv 04073; Address3: Ukraine; Address4: https://ajax.systems/en/; DocumentNumber: 7; Revision: v1; SheetNumber: 7; SheetTotal: 7; Product name: DEV.Tnn.BRD; Internal reference: 621; Head: DEV.Tnn.BRD.621.v1; PCB_Designator: DEV.Tnn.BRD.621.v1; Template_version: 1.0.1
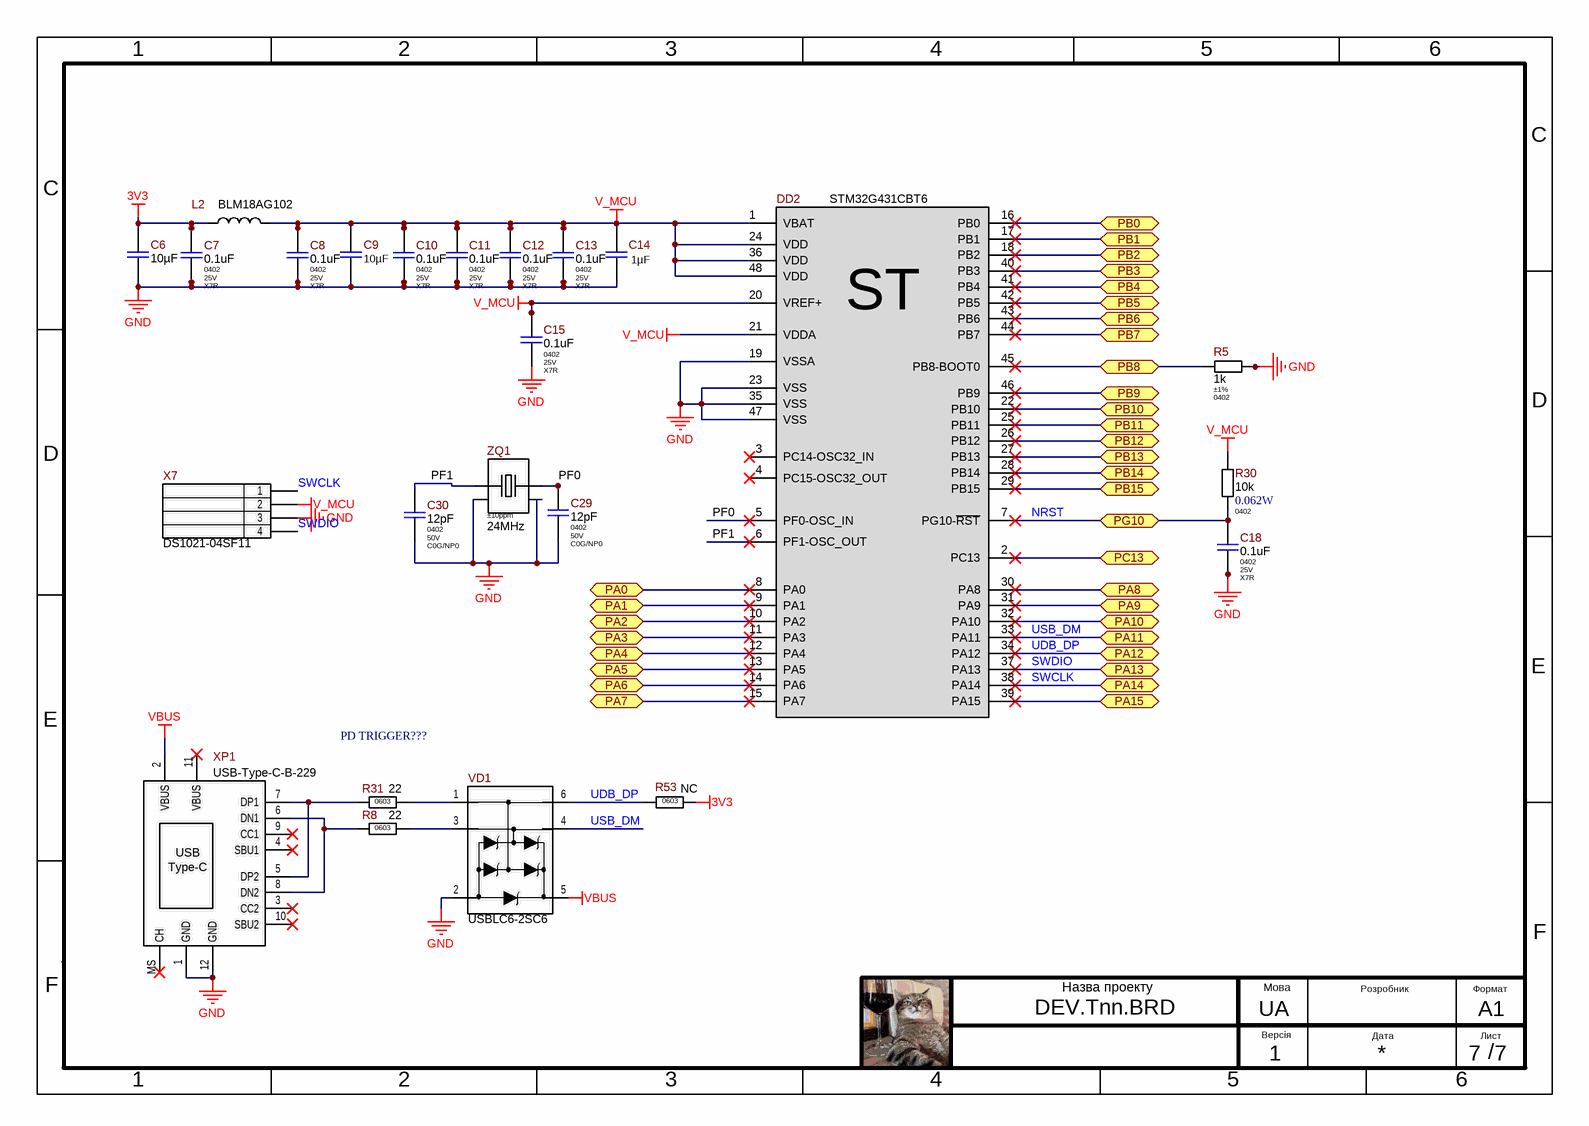
[diagram p2: MCU.SchDoc]

### Parts
C6  10µF  [C0603(1608)]
C7  0.1uF  Package: 0402  Voltage: 25V  Dielectric Type: X7R  [C_CERAMIC_0402_MED]
C8  0.1uF  Package: 0402  Voltage: 25V  Dielectric Type: X7R  [C_CERAMIC_0402_MED]
C9  10µF  [C0603(1608)]
C10  0.1uF  Package: 0402  Voltage: 25V  Dielectric Type: X7R  [C_CERAMIC_0402_MED]
C11  0.1uF  Package: 0402  Voltage: 25V  Dielectric Type: X7R  [C_CERAMIC_0402_MED]
C12  0.1uF  Package: 0402  Voltage: 25V  Dielectric Type: X7R  [C_CERAMIC_0402_MED]
C13  0.1uF  Package: 0402  Voltage: 25V  Dielectric Type: X7R  [C_CERAMIC_0402_MED]
C14  1µF  [C0603(1608)]
C15  0.1uF  Package: 0402  Voltage: 25V  Dielectric Type: X7R  [C_CERAMIC_0402_MED]
C18  0.1uF  Package: 0402  Voltage: 25V  Dielectric Type: X7R  [C_CERAMIC_0402_MED]
C29  12pF  Package: 0402  Voltage: 50V  Dielectric Type: C0G/NP0  [C_CERAMIC_0402_MED]
C30  12pF  Package: 0402  Voltage: 50V  Dielectric Type: C0G/NP0  [C_CERAMIC_0402_MED]
DD2  STM32G431CBT6  [LQFP48]
L2  BLM18AG102  [BLM18(0603)]
R5  Tolerance: ±1%  Package: 0402  [R_ANY_CHIP_0402_MED]  (hidden comment: 1k)
R8  22  Package/Case: 0603  [R0603]
R30  10k  Power Rating: 0.062W  Package: 0402  [R_ANY_CHIP_0402_MED]
R31  22  Package/Case: 0603  [R0603]
R53  Package/Case: 0603  [R0603]  (hidden comment: NC)
VD1  USBLC6-2SC6  [SOT-23-6]
X7  Part Number: DS1021-04SF11  [DS1021-04S]  (hidden comment: PLS-4 (Part of PLS-40))
XP1  USB-Type-C-B-229  [USB-Type-C-B-229]
ZQ1  Frequency Tolerance: ±10ppm  Frequency: 24MHz  [CXA-321_REC]  (hidden comment: C3E-24.000-18-1010-R)

### Ports
PA0 (bidir), PA1 (bidir), PA2 (bidir), PA3 (bidir), PA4 (bidir), PA5 (bidir), PA6 (bidir), PA7 (bidir), PA8 (bidir), PA9 (bidir), PA10 (bidir), PA11 (bidir), PA12 (bidir), PA13 (bidir), PA14 (bidir), PA15 (bidir), PB0 (bidir), PB1 (bidir), PB2 (bidir), PB3 (bidir), PB4 (bidir), PB5 (bidir), PB6 (bidir), PB7 (bidir), PB8 (bidir), PB9 (bidir), PB10 (bidir), PB11 (bidir), PB12 (bidir), PB13 (bidir), PB14 (bidir), PB15 (bidir), PC13 (bidir), PG10 (bidir)

### Nets
3V3: C6.1 C7.2 L2.1 R53.2
GND: C6.2 C7.1 C8.1 C9.2 C10.1 C11.1 C12.1 C13.1 C14.2 C15.1 C18.1 C29.2 C30.2 DD2.19(VSSA) DD2.23(VSS) DD2.35(VSS) DD2.47(VSS) R5.2 VD1.2(GND) X7.3 XP1.1(GND) XP1.12(GND) ZQ1.2(NC1) ZQ1.4(NC2)
V_MCU: C8.2 C9.1 C10.2 C11.2 C12.2 C13.2 C14.1 C15.2 DD2.1(VBAT) DD2.20(VREF+) DD2.21(VDDA) DD2.24(VDD) DD2.36(VDD) DD2.48(VDD) L2.2 R30.1 X7.2
VBUS: VD1.5(VBUS) XP1.2(VBUS)
cA0: DD2.28(PB14) ; port PB14
cALERT: DD2.16(PB0) ; port PB0
cLED: DD2.25(PB11) ; port PB11
cPWM_BUZ: DD2.32(PA10) ; port PA10
nRST: DD2.26(PB12) ; port PB12
NRST: C18.2 DD2.7(PG10-~{RST}) R30.2 ; port PG10  [a separate net that carries the same name]
PF0: C29.1 DD2.5(PF0-OSC_IN) ZQ1.3(XTAL2)
PF1: C30.1 DD2.6(PF1-OSC_OUT) ZQ1.1(XTAL1)
SCL: DD2.27(PB13) ; port PB13
SCL1: DD2.31(PA9) ; port PA9
SCL2: DD2.39(PA15) ; port PA15
SDA: DD2.29(PB15) ; port PB15
SDA1: DD2.30(PA8) ; port PA8
SDA2: DD2.44(PB7) ; port PB7
SWCLK: DD2.38(PA14) X7.1 ; port PA14
SWDIO: DD2.37(PA13) X7.4 ; port PA13
UDB_DP: DD2.34(PA12) R53.1 VD1.6(D+OUT) ; port PA12
USB_DM: DD2.33(PA11) VD1.4(D-OUT) ; port PA11
VREF9: DD2.12(PA4) ; port PA4
VREF10: DD2.13(PA5) ; port PA5
xALERT: DD2.17(PB1) ; port PB1
xENC_A: DD2.42(PB5) ; port PB5
xENC_B: DD2.41(PB4) ; port PB4
xENC_BUTTON: DD2.2(PC13) ; port PC13
xTHERMO_SENS1: DD2.8(PA0) ; port PA0
xTHERMO_SENS2: DD2.9(PA1) ; port PA1
xTHERMO_SENS3: DD2.10(PA2) ; port PA2
xTHERMO_SENS4: DD2.11(PA3) ; port PA3
xTHERMO_SENS5: DD2.14(PA6) ; port PA6
xTHERMO_SENS6: DD2.15(PA7) ; port PA7
NetDD2_18: DD2.18(PB2) ; port PB2
NetDD2_22: DD2.22(PB10) ; port PB10
NetDD2_40: DD2.40(PB3) ; port PB3
NetDD2_43: DD2.43(PB6) ; port PB6
NetDD2_45: DD2.45(PB8-BOOT0) R5.1 ; port PB8
NetDD2_46: DD2.46(PB9) ; port PB9
NetR8_1: R8.1 XP1.6(DN1) XP1.8(DN2)
NetR8_2: R8.2 VD1.3(D-IN)
NetR31_1: R31.1 XP1.5(DP2) XP1.7(DP1)
NetR31_2: R31.2 VD1.1(D+IN)

Not connected (* = marked no-connect by the designer): DD2 3(PC14-OSC32_IN)* 4(PC15-OSC32_OUT)*; XP1 3(CC2)* 4(SBU1)* 9(CC1)* 10(SBU2)* 11(VBUS)* MS(CH)*

### Notes on the sheet
- PD TRIGGER???
- 1
- 2
- 3
- 4
- 5
- 6
- C
- D
- E
- F
- Назва проекту
- Мова
- UA
- Розробник
- Формат
- A1
- Версія
- Дата
- Лист
- /
- (in symbol STM32G431CBT6) ST
- (in symbol USB-Type-C-B-229) USB; Type-C

### Library data of the parts
C6 C9 = 10µF  6.3V C0603: CAP CER 10UF 6.3V X5R 0603; Manufacturer: Murata Electronics North America; Manufacturer P/N: GRM185R60J106ME15D; Name Component: Capacitor Ceramic; Tolerance: ±20%; Operation Temperature: -55°C ~ 105°C; Notes: GRM185R60J106ME15J; Library Path 1: Capacitors.SchLib; Part Number: 10µF  6.3V C0603; Value: 10µF; Temperature Coefficient: X5R; Power (V/A): 6.3V; Package/Case: C0603; Supplier 1: Digi-key; Supplier Part Number 1: 490-10467-2-ND; ComponentLink1Description: Datasheet; ComponentLink1URL: https://www.murata.com/~/media/webrenewal/support/library/catalog/products/capacitor/mlcc/c02e.ashx?la=en-us
C7 C8 C10-C13 C15 C18 = GRM155R71E104KE14J: 100nF 25V X7R ±10% 0402 Ceramic Capacitor RoHS; Manufacturer: Murata Electronics; Ajax_1C_ID: 24481; Ajax_1C_PN: 100nF 25V X7R 10% 0402 GRM155R71E104KE14J Ceramic Capacitor SMD RoHS; Ajax_1С_Status: Mass Production; Component Status: Released; Standard Lead Time: 24 Weeks; Replacement: NONE; GUID_1C: 92ffc16c-33b6-11eb-ab6e-0050569f2651; Part Number: GRM155R71E104KE14J; Value: 0.1uF; Tolerance: ±10%; ComponentLink1Description: Datasheet; ComponentLink1URL: https://eu.mouser.com/datasheet/2/281/1/GRM155R71E104KE14_01A-1984358.pdf; Part Type: Ceramic / X7R / 0402; Component Type: SMD; Temperature Range: -55°C ~ 125°C; Price: 0.00630066
C14 = 1µF  25V C0603: CAP CER 1UF 25V X5R 0603; Manufacturer: AVX Corporation; Manufacturer P/N: 06033D105KAT2A; Name Component: Capacitor Ceramic; Tolerance: ±10%; Operation Temperature: -55°C ~ 105°C; Library Path 1: Capacitors.SchLib; Part Number: 1µF  25V C0603; Value: 1µF; Temperature Coefficient: X5R; Power (V/A): 25V; Package/Case: C0603; Supplier 1: Digi-key; Supplier Part Number 1: 478-5142-2-ND; ComponentLink1Description: Datasheet; ComponentLink1URL: http://catalogs.avx.com/SurfaceMount.pdf
C29 C30 = CL05C120JB5NNNC: 12pF 50V C0G ±5% 0402 Ceramic Capacitor RoHS; Manufacturer: Samsung Electro-Mechanics; Ajax_1C_ID: 15982; Ajax_1C_PN: 12pF 50V COG 5% 0402 CL05C120JB5NNNC Ceramic Capacitor SMD RoHS; Ajax_1С_Status: Mass Production; Component Status: Released; Standard Lead Time: 28 Weeks; Replacement: NONE; GUID_1C: 5e79e13c-76f0-11e9-ab56-0050569f2651; Part Number: CL05C120JB5NNNC; Value: 12pF; Tolerance: ±5%; Supplier 1: Digi-Key; Supplier Part Number 1: 1276-1178-2-ND; ComponentLink1Description: Datasheet; ComponentLink1URL: https://media.digikey.com/pdf/Data%20Sheets/Samsung%20PDFs/CL_Series_MLCC_ds.pdf; Part Type: Ceramic / C0G(NP0) / 0402; Component Type: SMD; Temperature Range: -55°C ~ 125°C; Price: 0.0022
DD2 = STM32G431CBT6: ARM® Cortex®-M4F STM32G4 Microcontroller IC 32-Bit Single-Core 170MHz 128KB (128K x 8) FLASH 48-LQFP (7x7); MF: STMicroelectronics; MP: STM32G431CBU6; Name Component: Microcontrollers; Operation Temperature: -40°C ~ 85°C (TA); Power (V/A): 1.71V ~ 3.6V; Library Path 1: Integrated Circuit.SchLib; SnapEDA_Link: https://www.snapeda.com/parts/STM32G431CBU6/STMicroelectronics/view-part/?ref=snap; Package: UFQFPN-48 STMicroelectronics; Value: STM32G431CBT6; Check_prices: https://www.snapeda.com/parts/STM32G431CBU6/STMicroelectronics/view-part/?ref=eda; Part Number: STM32G431CBT6; Package/Case: 48-LQFP; Manufacturer: STMicroelectronics; Manufacturer P/N: STM32G431CBT6; Supplier 1: Digi-key; Supplier Part Number 1: 497-19475-ND; ComponentLink1Description: Datasheet; ComponentLink1URL: https://www.st.com/resource/en/datasheet/stm32g431cb.pdf
L2 = BLM18AG102: FERRITE BEAD 1 KOHM 0603 1LN; Manufacturer: Murata Electronics North America; Manufacturer P/N: BLM18AG102SZ1D; Name Component: Ferrite Beads; Tolerance: ±25%; Power (V/A): 400mA; Library Path 1: Inductance.SchLib; Part Number: BLM18AG102; Value: BLM18AG102; Package/Case: 0603 (1608 Metric); Supplier 1: Digi-key; Supplier Part Number 1: 490-16503-2-ND; ComponentLink1Description: Datasheet; ComponentLink1URL: https://media.digikey.com/pdf/Data%20Sheets/Murata%20PDFs/BLM18yyyyyyN1x.pdf
R5 = RC0402FR-071KL: 1 kOhms ±1% 1/16W 0402 Thick Film Resistor; Manufacturer: Yageo; Power Rating: 0.062W; Ajax_1C_ID: 4845; Ajax_1C_PN: 1k 1% 0402 Resistors SMD RoHS; Ajax_1С_Status: Mass Production; Component Status: Released; Voltage: 50V; Temperature Stability: ±100ppm/°C; Replacement: NONE; GUID_1C: bf05aaa5-08f0-11e4-b679-a45d36c4a9e5; Value: 1k; Part Number: RC0402FR-071KL; Part Type: Thick Film; Component Type: SMD; Temperature Range: -55°C ~ 155°C; ComponentLink1URL: https://eu.mouser.com/datasheet/2/447/PYu_RC_Group_51_RoHS_L_11-1984063.pdf; Supplier 1: Digi-Key; Supplier Part Number 1: 311-1.00KLRTR-ND; Price: 0.0007; ComponentLink1Description: Datasheet
R8 R31 = 22  R0603: RES SMD 22 OHM  ±1% 1/10W 0603; Name Component: Resistror; Operation Temperature: -55℃ to 155℃; Temperature Coefficient: ±100 ppm/°C; Library Path 1: Resistor.SchLib; Part Number: 22  R0603; Value: 22; Tolerance: ±1%
R30 = RC0402JR-0710KL: 10 kOhms ±5% 1/16W 0402 Thick Film Resistor; Manufacturer: Yageo; Ajax_1C_ID: 3447; Ajax_1C_PN: 10k 5% 0402 Resistors SMD RoHS; Ajax_1С_Status: Mass Production; Component Status: Released; Voltage: 50V; Temperature Stability: ±100ppm/°C; Replacement: NONE; GUID_1C: 0d073320-42e0-11e3-bb71-6c626deda1bb; Part Number: RC0402JR-0710KL; Value: 10k; Tolerance: ±5%; Part Type: Thick Film; Component Type: SMD; Temperature Range: -55°C ~ 155°C; ComponentLink1URL: https://eu.mouser.com/datasheet/2/447/PYu_RC_Group_51_RoHS_L_10-1664068.pdf; Supplier 1: Digi-Key; Supplier Part Number 1: 311-10KJRTR-ND; Price: 0.0005; ComponentLink1Description: Datasheet
R53 = 1.5 k  R0603: RES SMD 1.5 k OHM  ±1% 1/10W 0603; Power Rating: 0.1W; Name Component: Resistror; Operation Temperature: -55℃ to 155℃; Temperature Coefficient: ±100 ppm/°C; Library Path 1: Resistor.SchLib; Value: NC; Part Number: 1.5 k  R0603
VD1 = USBLC6-2SC6: TVS DIODE 5.25V 17V SOT23-6; Manufacturer: STMicroelectronics; Name Component: TVS - Diodes; Operation Temperature: -40°C ~ 125°C (TJ); Power Rating: 17V 5A; Library Path 1: Diodes.SchLib; ComponentLink1URL: https://www.st.com/resource/en/datasheet/usblc6-2.pdf; ComponentLink1Description: Datasheet; Part Number: USBLC6-2SC6; Value: USBLC6-2SC6; Package/Case: SOT-23-6; Manufacturer P/N: USBLC6-2SC6; Supplier 1: Digi-key; Supplier Part Number 1: 497-5235-2-ND
X7 = DS1021-04SF11: as X5 on sheet ELOAD; Part Type: Header / Male Pin / Single Row; Component Type: PTH; Temperature Range: -40°C ~ 105°C; ComponentLink1URL: \\altiumdb.ajax.local\files\Datasheet\Connectors\DS1021.pdf; Price: 0.00351512; ComponentLink1Description: Datasheet
XP1 = USB-Type-C-B-229: Manufacturer: KLS ELECTRONIC CO., LTD.; Operation Temperature: -55 °C to +105 °C; Power (V/A): 3А 250В; Library Path 1: Connectors.SchLib; Part Number: USB-Type-C-B-229; Name Component: USB-Type-C; Value: USB-Type-C-B-229; Package/Case: USB-Type-C-B-229; Supplier 1: Kosmodrom; ComponentLink1Description: Datasheet; ComponentLink1URL: http://www.kosmodrom.com.ua/pdf/USB-Type-C-B-229.pdf
ZQ1 = C3E-24.000-18-1010-R: 24MHz, 18pF, ±10ppm, 100Ohm ESR, 100uW DL Crystal Quartz; Manufacturer: Aker; Ajax_1C_ID: 112658; Ajax_1C_PN: Crystal C3E-24.000-18-1010-R (CXAN-024000-3F18F00) 24MHz 10ppm 18pF 3.2x2.5mm SMD Aker Technology Corp; Ajax_1С_Status: Mass Production; Component Status: Released; Standard Lead Time: NONE; GUID_1C: 0303893b-6f74-11ef-b61c-0050569991a1; Part Number: C3E-24.000-18-1010-R; Part Type: Crystal; Component Type: SMD; Load Capacitance: 18pF; Frequency Stability: ±10ppm; Temperature Range: -10°C ~ 70 °C; ComponentLink1URL: https://aker-usa.com/files/content/products/crystals/C3E-General-Specification.pdf; Replacement: NONE; Price: 0.093; ComponentLink1Description: Datasheet

## Sheet DAC.SchDoc: =DocumentName
size A4; CompanyName: "AS Manufacturing" LLC; Organization: "AS Manufacturing" LLC; Address1: 5 Sklyarenka St.; Address2: Kyiv 04073; Address3: Ukraine; Address4: https://ajax.systems/en/; DocumentNumber: 4; Revision: v1; SheetNumber: 4; SheetTotal: 7; Product name: DEV.Tnn.BRD; Internal reference: 621; Head: DEV.Tnn.BRD.621.v1; PCB_Designator: DEV.Tnn.BRD.621.v1; Template_version: 1.0.1
Used 2 times, as channels U_DAC, U_DAC. Parts and nets are listed once, with the designators drawn on the sheet.
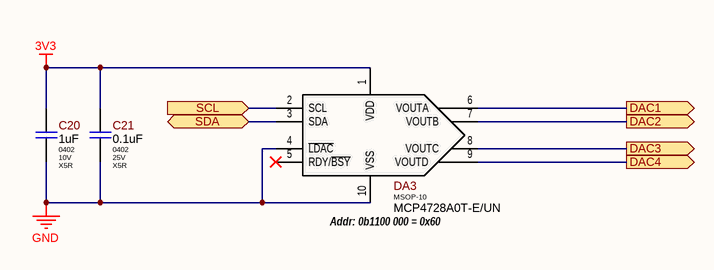
[diagram p3: DAC.SchDoc]

### Parts
C20  Package: 0402  Voltage: 10V  Dielectric Type: X5R  [C_CERAMIC_0402_MED]  (hidden comment: 1uF)
C21  Package: 0402  Voltage: 25V  Dielectric Type: X5R  [C_CERAMIC_0402_MED]  (hidden comment: 0.1uF)
DA3  MCP4728A0T-E/UN  [MSOP-10]

### Ports
DAC1 (out), DAC2 (out), DAC3 (out), DAC4 (out), SCL (in), SDA (bidir)

### Nets
3V3: C20.1 C21.1 DA3.1(VDD)
GND: C20.2 C21.2 DA3.4(~{LDAC}) DA3.10(VSS)
DAC1: DA3.6(VOUTA) ; port DAC1
DAC2: DA3.7(VOUTB) ; port DAC2
DAC3: DA3.8(VOUTC) ; port DAC3
DAC4: DA3.9(VOUTD) ; port DAC4
SCL: DA3.2(SCL) ; port SCL
SDA: DA3.3(SDA) ; port SDA

Not connected (* = marked no-connect by the designer): DA3 5(RDY/~{BSY})*

### Channels
U_DAC: designators end in B; ports DAC1=VREF3 DAC2=VREF4 DAC3=VREF1 DAC4=VREF2 SCL=SCL1 SDA=SDA1
U_DAC: designators end in A; ports DAC1=VREF5 DAC2=VREF6 DAC3=VREF7 DAC4=VREF8 SCL=SCL2 SDA=SDA2

### Notes on the sheet
- (near DA3) Addr: 0b1100 000 = 0x60
- Title
- Product:
- Project:
- Size:
- Date:
- Variant:
- A4
- Authors:
- Time:
- Sheet
- of
- Rev:
- Commit:

### Library data of the parts
C20 = CL05A105KP5NNNC: 1uF 10V Х5R ±10% 0402 Ceramic Capacitor RoHS; Manufacturer: Samsung Electro-Mechanics; Ajax_1C_ID: 23659; Ajax_1C_PN: 1uF 10V Х5R 10% 0402 Samsung CL05A105KP5NNNC Ceramic Capacitor SMD RoHS; Standard Lead Time: 18 Weeks; Replacement: NONE; Ajax_1С_Status: Mass Production; Component Status: Released; GUID_1C: 556ec478-1f42-11eb-ab6d-0050569f2651; Value: 1uF; Part Number: CL05A105KP5NNNC; Part Type: Ceramic / X5R / 0402; Component Type: SMD; Temperature Range: -55°C ~ 85°C; Tolerance: ±10%; ComponentLink1URL: https://media.digikey.com/pdf/Data%20Sheets/Samsung%20PDFs/CL_Series_MLCC_ds.pdf; Supplier 1: Digi-Key; Supplier Part Number 1: 1276-1076-2-ND; ComponentLink1Description: Datasheet; Price: 0.00141
C21 = CL05A104KA5NNNC: 100nF 25V X5R ±10% 0402 Ceramic Capacitor RoHS; Manufacturer: Samsung Electro-Mechanics; Ajax_1C_ID: 27170; Ajax_1C_PN: 100nF 25V X5R 10% 0402 CL05A104KA5NNNC Ceramic Capacitor SMD RoHS; Standard Lead Time: 38 Weeks; Component Status: Released; Replacement: NONE; GUID_1C: 6c9121f0-7733-11eb-ab70-0050569f2651; Ajax_1С_Status: Mass Production; Value: 0.1uF; Part Number: CL05A104KA5NNNC; Part Type: Ceramic / X5R / 0402; Component Type: SMD; Temperature Range: -55°C ~ 85°C; Tolerance: ±10%; ComponentLink1URL: https://eu.mouser.com/datasheet/2/585/MLCC-1837944.pdf; ComponentLink1Description: Datasheet; Price: 0.0013; Supplier 1: Mouser; Supplier Part Number 1: 187-CL05A104KA5NNNC
DA3 = MCP4728A0T-E/UN: 12-Bit, Quad Digital-to-Analog Converter with EEPROM Memory, MSOP-10; Manufacturer: Microchip Technology; Ajax_1C_ID: 39734; Ajax_1C_PN: MCP4728A0T-E/UN MSOP-10 мікросхема; Ajax_1С_Status: Mass Production; Standard Lead Time: 52 Weeks; Component Status: Released; Replacement: NONE; GUID_1C: ce0ad344-8e40-11ec-a90d-00505699469b; Package: MSOP-10; Part Number: MCP4728A0T-E/UN; Part Type: DAC; Component Type: SMD; Temperature Range: -40°C ~ 125°C; ComponentLink1URL: https://ww1.microchip.com/downloads/en/DeviceDoc/22187E.pdf; Supplier 1: Digi-Key; Supplier Part Number 1: MCP4728A0T-E/UNTR-ND; Price: 2.09; ComponentLink1Description: Datasheet

## Sheet INA228.SchDoc: =DocumentName
size 297 x 209 mm; CompanyName: "AS Manufacturing" LLC; Organization: "AS Manufacturing" LLC; Address1: 5 Sklyarenka St.; Address2: Kyiv 04073; Address3: Ukraine; Address4: https://ajax.systems/en/; DocumentNumber: 5; Revision: v1; SheetNumber: 5; SheetTotal: 7; Product name: DEV.Tnn.BRD; Internal reference: 621; Head: DEV.Tnn.BRD.621.v1; PCB_Designator: DEV.Tnn.BRD.621.v1; Template_version: 1.0.1
Used 3 times, as channels U_INA228, U_INA228, U_INA228. Parts and nets are listed once, with the designators drawn on the sheet.
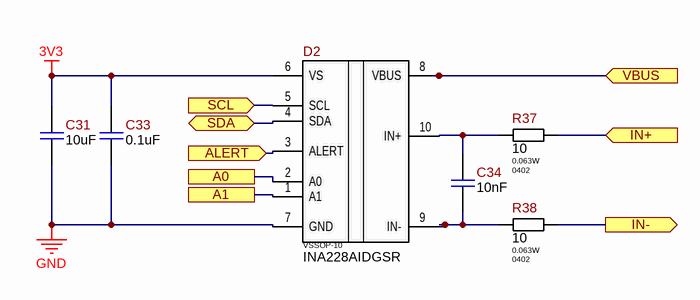
[diagram p4: INA228.SchDoc]

### Parts
C31  10uF  [C0402(1005)]
C33  0.1uF  [C0402(1005)]
C34  10nF  [C0402(1005)]
D2  Package: VSSOP-10  [TI-VSSOP-10-50P490X110]  (hidden comment: INA228AIDGSR)
R37  10  Power Rating: 0.063W  Package/Case: 0402  [R0402]
R38  10  Power Rating: 0.063W  Package/Case: 0402  [R0402]

### Ports
A0, A1, ALERT (in), IN+ (in), IN- (out), SCL (in), SDA (bidir), VBUS (in)

### Nets
3V3: C31.2 C33.2 D2.6(VS)
GND: C31.1 C33.1 D2.7(GND)
A0: D2.2(A0) ; port A0
A1: D2.1(A1) ; port A1
ALERT: D2.3(ALERT) ; port ALERT
IN+: R37.2 ; port IN+
IN-: R38.2 ; port IN-
SCL: D2.5(SCL) ; port SCL
SDA: D2.4(SDA) ; port SDA
VBUS: D2.8(VBUS) ; port VBUS
NetC34_1: C34.1 D2.9(IN-) R38.1
NetC34_2: C34.2 D2.10(IN+) R37.1

### Channels
U_INA228: designators end in C; ports A0=GND A1=GND ALERT=cAL IN+=NetR17A_1 IN-=NetR17B_1 SCL=SCL SDA=SDA VBUS=NetD2C_8
U_INA228: designators end in B; ports A0=3V3 A1=GND ALERT=cAL IN+=NetR17B_1 IN-=NetR17C_1 SCL=SCL SDA=SDA VBUS=NetD2B_8
U_INA228: designators end in A; ports A0=3V3 A1=3V3 ALERT=cAL IN+=NetR17C_1 IN-=GND SCL=SCL SDA=SDA VBUS=NetD2A_8

### Notes on the sheet
- 1
- 2
- 3
- 4
- 5
- 6
- C
- D
- E
- F
- Назва проекту
- Мова
- UA
- Розробник
- Формат
- A4
- Версія
- Дата
- Лист
- /

### Library data of the parts
C31 = 10uF  6.3V C0402: CAP CER 10UF 6.3V X6S 0402; Manufacturer: Murata Electronics North America; Manufacturer P/N: GRM155C80J106ME11D; Name Component: Capacitor Ceramic; Tolerance: ±20%; Operation Temperature: -55°C ~ 105°C; Library Path 1: Capacitors.SchLib; Part Number: 10uF  6.3V C0402; Value: 10uF; Temperature Coefficient: X6S; Power (V/A): 6.3V; Package/Case: C0402; Supplier 1: Digi-key; Supplier Part Number 1: 490-13233-2-ND; ComponentLink1Description: Datasheet; ComponentLink1URL: https://www.murata.com/~/media/webrenewal/support/library/catalog/products/capacitor/mlcc/c02e.ashx?la=en-us
C33 = 0.1uF  25V C0403: CAP CER 0.1UF 25V X7R 0603; Manufacturer: Samsung Electro-Mechanics; Name Component: Capacitor Ceramic; Tolerance: ±10%; Operation Temperature: -55°C ~ 125°C; Library Path 1: Capacitors.SchLib; Part Number: 0.1uF  25V C0403; Value: 0.1uF; Temperature Coefficient: X7R; Power (V/A): 25V; Package/Case: C0403; Supplier Part Number 1: 1276-6854-2-ND; ComponentLink1Description: Datasheet
C34 = 10nF  50V C0402: CAP CER 10NF 50V NP0 0603; Manufacturer: AVX Corporation; Name Component: Capacitor Ceramic; Tolerance: ±0.25pF; Operation Temperature: -55°C ~ 105°C; Temperature Coefficient: C0G, NP0; Library Path 1: Capacitors.SchLib; Part Number: 10nF  50V C0402; Value: 10nF; Power (V/A): 50V; Package/Case: C0402; Supplier 1: Digi-key; ComponentLink1Description: Datasheet
D2 = INA228AIDGSR: 85V, 20Bit, Ultra-Precise Power/Energy/Charge Monitor With I2C, 2.7V to 5.5V Supply, VSSOP-10; Manufacturer: Texas Instruments; Ajax_1C_ID: 73549; Ajax_1C_PN: INA228AIDGSR IC Power Supply Controller VSSOP-10 TI; Ajax_1С_Status: Mass Production; Component Status: Released; Standard Lead Time: 57 Weeks; Replacement: NONE; GUID_1C: d5df315a-0f3b-11ee-a36c-005056994834; Part Number: INA228AIDGSR; Part Type: Amplifier / Current Sense; Component Type: SMD; Temperature Range: -40°C ~ 125°C; ComponentLink1URL: https://www.ti.com/lit/ds/symlink/ina228.pdf; Supplier 1: Digi-Key; Supplier Part Number 1: 296-INA228AIDGSRTR-ND; Price: 3.28; ComponentLink1Description: Datasheet
R37 R38 = 10  R0402: RES SMD 10 OHM  ±1% 1/16W 0402; Name Component: Resistror; Operation Temperature: -55℃ to 155℃; Temperature Coefficient: ±200 ppm/°C; Library Path 1: Resistor.SchLib; Part Number: 10  R0402; Value: 10; Tolerance: ±1%